# EAGLE schematic motor-no-half-bridge (EAGLE 7.2.0)
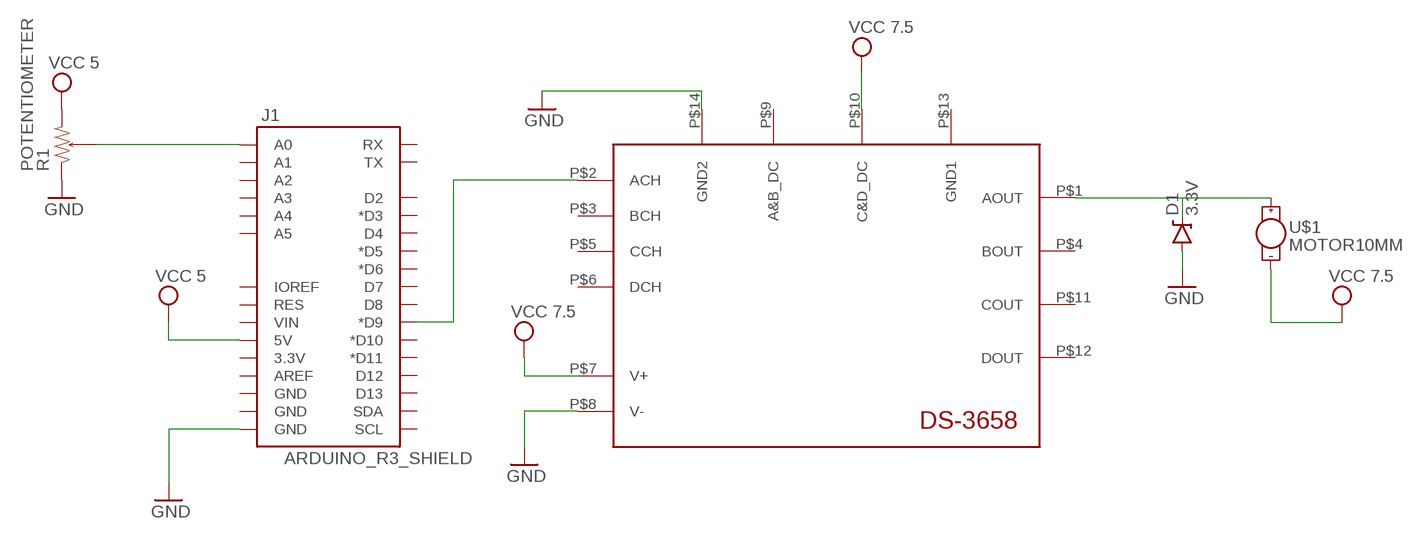
[diagram p0: schematic, sheet 1]

## Parts
D1  3.3V  DIODE-ZENER3.3V  [SOD-323]
DS1  DS-3658  [DS-3658]
J1  ARDUINO_R3_SHIELD  [UNO_R3_SHIELD]
R1  POTENTIOMETER  [0603-ARV]
U$1  MOTOR10MM  [VIBE-MOTOR-10MM]

## Nets
GND: DS1.P$8(V-) DS1.P$14(GND2) J1.GND@0(GND) R1.1
N$1: J1.A0 R1.3 R1.4 R1.5 R1.6 R1.7 R1.8
N$2: D1.C DS1.P$1(AOUT) U$1.+
N$3: D1.A ; supply symbol labelled GND
N$4: DS1.P$2(ACH) J1.D9(*D9)
VCC: DS1.P$7(V+) DS1.P$10(C&D_DC) J1.5V R1.2 U$1.- ; supply symbol labelled VCC 5, VCC 7.5
Unconnected: DS1.P$3(BCH) DS1.P$4(BOUT) DS1.P$5(CCH) DS1.P$6(DCH) DS1.P$9(A&B_DC) DS1.P$11(COUT) DS1.P$12(DOUT) DS1.P$13(GND1) J1.3.3V J1.A1 J1.A2 J1.A3 J1.A4 J1.A5 J1.AREF J1.D2 J1.D3(*D3) J1.D4 J1.D5(*D5) J1.D6(*D6) J1.D7 J1.D8 J1.D10(*D10) J1.D11(*D11) J1.D12 J1.D13 J1.GND@1(GND) J1.GND@2(GND) J1.IOREF J1.RES J1.RX J1.SCL J1.SDA J1.TX J1.VIN

## Library data of the parts
D1 = SparkFun-DiscreteSemi:DIODE-ZENER: Zener Diode Production Part - 8199 3.4V Zener Voltage; PROD_ID: DIO-11284
DS1 = me210:DS-3658: DS-3658 Power Driver
J1 = SparkFun-Boards:ARDUINO_R3_SHIELD: Shield form compatible with the Arduino Uno R3.
R1 = SparkFun-Passives:POTENTIOMETER
U$1 = SparkFun-Electromechanical:MOTOR: Vibration Motor- ROB-08449 Physical dimension and wire connections for this powerful vibration motor. Motor has a self adhesive backing.